# Altium project PCB_Project_3.PrjPcb
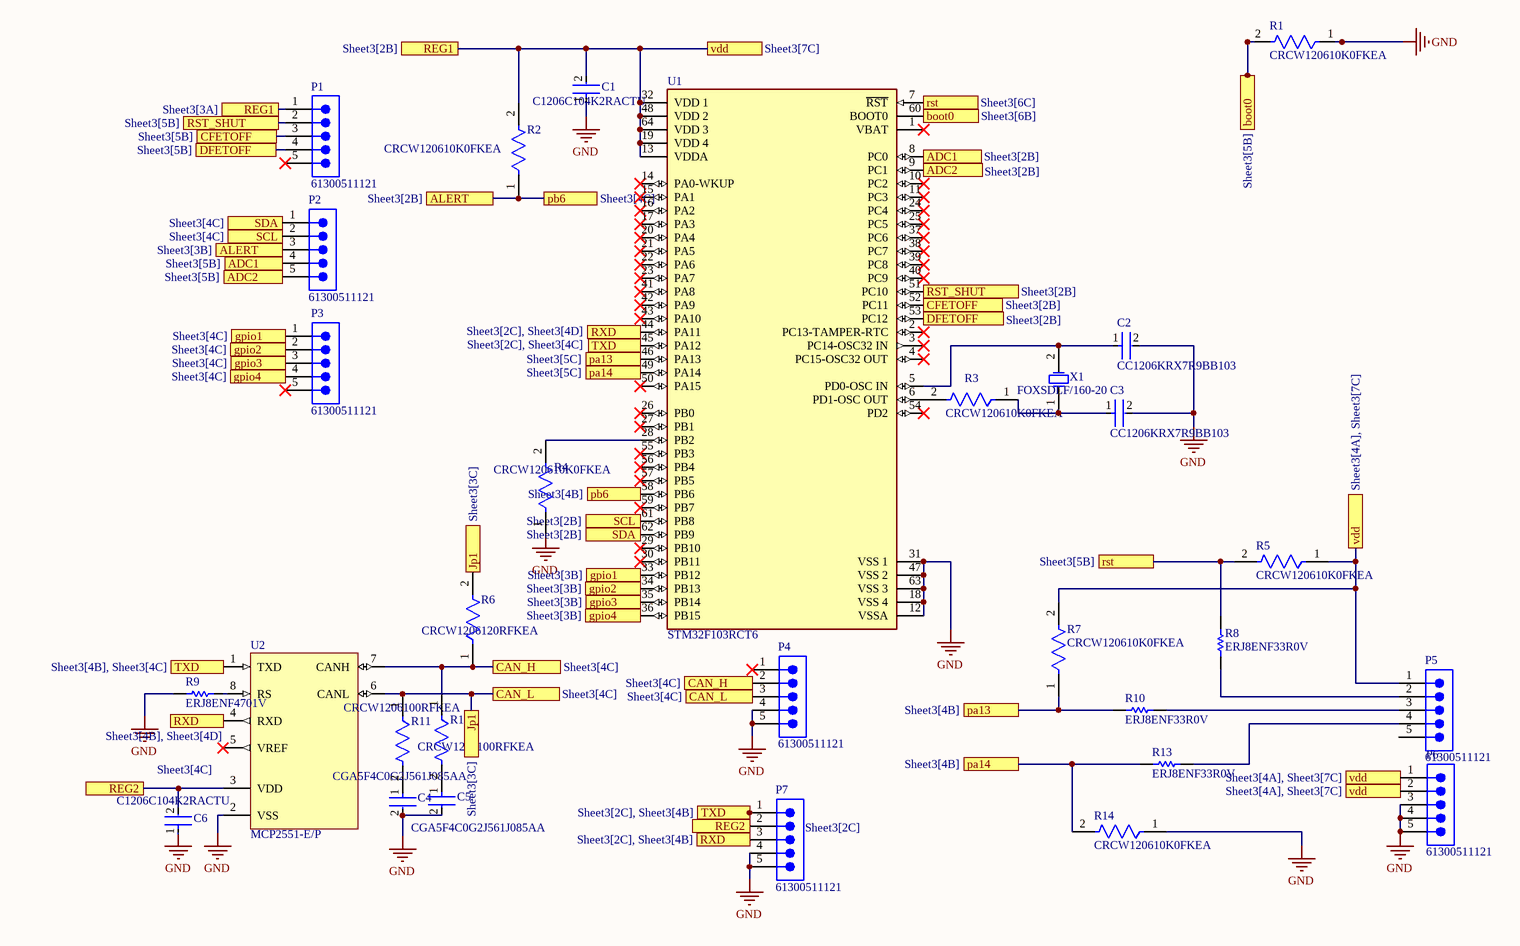
[diagram p0: Sheet3.SchDoc]
2 sheets, 116 parts. Net scope: flat (ports and power ports of the same name join across sheets).
Board file: PCB1.PcbDoc
Sheets:
  Sheet3.SchDoc
  Sheet1.SchDoc

## Sheet Sheet3.SchDoc
size A3; SheetNumber: 1; SheetTotal: 2

### Parts
C1  C1206C104K2RACTU  [FP-C1206C-EB-MFG]
C2  CC1206KRX7R9BB103  [FP-CC1206-1_25-MFG]
C3  CC1206KRX7R9BB103  [FP-CC1206-1_25-MFG]
C4  CGA5F4C0G2J561J085AA  [FP-CGA5L-0_3-0_1-MFG]
C5  CGA5F4C0G2J561J085AA  [FP-CGA5L-0_3-0_1-MFG]
C6  C1206C104K2RACTU  [FP-C1206C-EB-MFG]
P1  61300511121  [61300511121]
P2  61300511121  [61300511121]
P3  61300511121  [61300511121]
P4  61300511121  [61300511121]
P5  61300511121  [61300511121]
P6  61300511121  [61300511121]
P7  61300511121  [61300511121]
R1  CRCW120610K0FKEA  [FP-CRCW1206-e3-IPC_C]
R2  CRCW120610K0FKEA  [FP-CRCW1206-e3-IPC_C]
R3  CRCW120610K0FKEA  [FP-CRCW1206-e3-IPC_C]
R4  CRCW120610K0FKEA  [FP-CRCW1206-e3-IPC_C]
R5  CRCW120610K0FKEA  [FP-CRCW1206-e3-IPC_C]
R6  CRCW1206120RFKEA  [FP-CRCW1206-e3-MFG]
R7  CRCW120610K0FKEA  [FP-CRCW1206-e3-IPC_C]
R8  ERJ8ENF33R0V  [RESC3216X70X50LL05T20]
R9  ERJ8ENF4701V  [RESC3216X70X50LL05T20]
R10  ERJ8ENF33R0V  [RESC3216X70X50LL05T20]
R11  CRCW1206100RFKEA  [FP-CRCW1206-e3-MFG]
R12  CRCW1206100RFKEA  [FP-CRCW1206-e3-MFG]
R13  ERJ8ENF33R0V  [RESC3216X70X50LL05T20]
R14  CRCW120610K0FKEA  [FP-CRCW1206-e3-IPC_C]
U1  STM32F103RCT6  [FP-LQFP64-5W-MFG]
U2  MCP2551-E/P  [PDIP300-P8]
X1  FOXSDLF/160-20  [FOX-FOXSDLF160-20_V]

### Ports
ADC1 (see Sheet3[2B]), ADC1 (see Sheet3[5B]), ADC2 (see Sheet3[2B]), ADC2 (see Sheet3[5B]), ALERT (see Sheet3[2B]), ALERT (see Sheet3[3B]), boot0 (see Sheet3[5B]), boot0 (see Sheet3[6B]), CAN_H (see Sheet3[4C]), CAN_L (see Sheet3[4C]), CFETOFF (see Sheet3[2B]), CFETOFF (see Sheet3[5B]), DFETOFF (see Sheet3[2B]), DFETOFF (see Sheet3[5B]), gpio1 (see Sheet3[3B]), gpio1 (see Sheet3[4C]), gpio2 (see Sheet3[3B]), gpio2 (see Sheet3[4C]), gpio3 (see Sheet3[3B]), gpio3 (see Sheet3[4C]), gpio4 (see Sheet3[3B]), gpio4 (see Sheet3[4C]), Jp1 (see Sheet3[3C]), pa13 (see Sheet3[4B]), pa13 (see Sheet3[5C]), pa14 (see Sheet3[4B]), pa14 (see Sheet3[5C]), pb6 (see Sheet3[4B]), pb6 (see Sheet3[4C]), REG1 (see Sheet3[2B]), REG1 (see Sheet3[3A]), REG2 (see Sheet3[2C]), REG2 (see Sheet3[4C]), rst (see Sheet3[5B]), rst (see Sheet3[6C]), RST_SHUT (see Sheet3[2B]), RST_SHUT (see Sheet3[5B]), RXD (see Sheet3[2C], Sheet3[4B]), RXD (see Sheet3[2C], Sheet3[4D]), RXD (see Sheet3[4B], Sheet3[4D]), SCL (see Sheet3[2B]), SCL (see Sheet3[4C]), SDA (see Sheet3[2B]), SDA (see Sheet3[4C]), TXD (see Sheet3[2C], Sheet3[4B]), TXD (see Sheet3[2C], Sheet3[4C]), TXD (see Sheet3[4B], Sheet3[4C]), vdd (see Sheet3[4A], Sheet3[7C]), vdd (see Sheet3[7C])

### Nets
GND: C1.1 C2.2 C3.2 C4.2 C5.2 C6.1 P4.4 P4.5 P6.3 P6.4 P6.5 P7.4 P7.5 R1.1 R4.1 R9.1 R14.1 U1.12(VSSA) U1.18(VSS_4) U1.31(VSS_1) U1.47(VSS_2) U1.63(VSS_3) U2.2(VSS)
NetC1_2: C1.2 P1.1 P5.1 P6.1 P6.2 R2.2 R5.1 R7.2 U1.13(VDDA) U1.19(VDD_4) U1.32(VDD_1) U1.48(VDD_2) U1.64(VDD_3) ; port vdd, port REG1
NetC2_1: C2.1 U1.5(PD0-OSC_IN) X1.2(X2)
NetC3_1: C3.1 R3.1 X1.1(X1)
NetC4_1: C4.1 R11.2
NetC5_1: C5.1 R12.2
NetC6_2: C6.2 P7.2 U2.3(VDD) ; port REG2
NetP1_2: P1.2 U1.51(PC10) ; port RST_SHUT
NetP1_3: P1.3 U1.52(PC11) ; port CFETOFF
NetP1_4: P1.4 U1.53(PC12) ; port DFETOFF
NetP2_1: P2.1 U1.62(PB9) ; port SDA
NetP2_2: P2.2 U1.61(PB8) ; port SCL
NetP2_3: P2.3 R2.1 U1.58(PB6) ; port ALERT, port pb6
NetP2_4: P2.4 U1.8(PC0) ; port ADC1
NetP2_5: P2.5 U1.9(PC1) ; port ADC2
NetP3_1: P3.1 U1.33(PB12) ; port gpio1
NetP3_2: P3.2 U1.34(PB13) ; port gpio2
NetP3_3: P3.3 U1.35(PB14) ; port gpio3
NetP3_4: P3.4 U1.36(PB15) ; port gpio4
NetP4_2: P4.2 R6.1 R12.1 U2.7(CANH) ; port CAN_H
NetP4_3: P4.3 R6.2 R11.1 U2.6(CANL) ; port Jp1, port CAN_L
NetP5_2: P5.2 R8.1
NetP5_3: P5.3 R10.2
NetP5_4: P5.4 R13.2
NetP7_1: P7.1 U1.45(PA12) U2.1(TXD) ; port TXD
NetP7_3: P7.3 U1.44(PA11) U2.4(RXD) ; port RXD
NetR1_2: R1.2 U1.60(BOOT0) ; port boot0
NetR3_2: R3.2 U1.6(PD1-OSC_OUT)
NetR4_2: R4.2 U1.28(PB2)
NetR5_2: R5.2 R8.2 U1.7(~{RST}) ; port rst
NetR7_1: R7.1 R10.1 U1.46(PA13) ; port pa13
NetR9_2: R9.2 U2.8(RS)
NetR13_1: R13.1 R14.2 U1.49(PA14) ; port pa14

Not connected (* = marked no-connect by the designer): P1 5*; P3 5*; P4 1*; P5 5; U1 1(VBAT)* 2(PC13-TAMPER-RTC)* 3(PC14-OSC32_IN)* 4(PC15-OSC32_OUT)* 10(PC2)* 11(PC3)* 14(PA0-WKUP)* 15(PA1)* 16(PA2)* 17(PA3)* 20(PA4)* 21(PA5)* 22(PA6)* 23(PA7)* 24(PC4)* 25(PC5)* 26(PB0)* 27(PB1)* 29(PB10)* 30(PB11)* 37(PC6)* 38(PC7)* 39(PC8)* 40(PC9)* 41(PA8)* 42(PA9)* 43(PA10)* 50(PA15)* 54(PD2)* 55(PB3)* 56(PB4)* 57(PB5)* 59(PB7)*; U2 5(VREF)*

### Library data of the parts
C1 C6 = CMP-1037-04222-2: CAP CER 0.1UF 200V 10% X7R 1206; Manufacturer: KEMET; Automotive Grade: Grade 0; Tolerance: 0.1; Value: 0.10 μF; Material: Ceramic; Temperature Coefficient: 15%; Automotive: Yes; Temperature Characteristic: X7R; Digikey Description: CAP CER 0.1UF 200V 10% X7R 1206; ComponentLink2URL: https://content.kemet.com/datasheets/KEM_C1007_X8R_ULTRA_150C_SMD.pdf; Voltage Rating: 200 V; Manufacturer Part Number: C1206C104K2RACTU; Temperature Range High: +150°C; Device Class L1: Passive Components; Octopart: https://octopart.com/c1206c104k2ractu-kemet-9138344; Temperature: -55°C to +150°C; Height: 0.88mm; Device Class L3: Ceramic Capacitors; Lead Free: Yes; Package: C1206C-EB; Category: Cap; Temperature Range Low: -55°C; Mouser Description: Multilayer Ceramic Capacitors MLCC - SMD/SMT 200volts 0.1uF X7R 10%; Ipc Land Pattern Name: CAPC320160X78; Capacitance: 0.10 μF; RoHS: TRUE; ComponentLink2Description: Datasheet; Device Class L2: Capacitors
C2 C3 = CMP-1037-03511-2: CAP CER 10000PF 50V X7R 1206; Manufacturer: Yageo; Automotive Grade: NA; Temperature Coefficient: 15%; Tolerance: 0.1; Capacitance: 10 nF; Value: 10 nF; Material: Ceramic; RoHS: TRUE; Lead Free: Yes; Category: Cap; Temperature Characteristic: X7R; ComponentLink2Description: Datasheet; Device Class L2: Capacitors; Voltage Rating: 50 V; Octopart: https://octopart.com/cc1206krx7r9bb103-yageo-39467800; Temperature Range Low: -55°C; Digikey Description: CAP CER 10000PF 50V X7R 1206; ComponentLink2URL: http://www.yageo.com/documents/recent/UPY-NP0X7R_HV_1KV-to-3KV_11.pdf; Package: CC1206-1.25; Height: 1.45mm; Automotive: No; Mouser Description: Multilayer Ceramic Capacitors MLCC - SMD/SMT 10nF 50V X7R 10%; Temperature Range High: +125°C; Manufacturer Part Number: CC1206KRX7R9BB103; Device Class L3: Ceramic Capacitors; Temperature: -55°C to +125°C; Footprint Url: http://www.yageo.com/exep/pages/download/literatures/UPY-C_GEN_24.pdf; Device Class L1: Passive Components
C4 C5 = CMP-08246-001106-1: Cap Ceramic 560pF 630V C0G 5% Pad SMD 1206 +125°C Automotive T/R; Height: 0.85mm; Mount: Surface Mount; Packaging: Tape and Reel; Thickness: 0.03inch; Case/Package: 1206; REACH SVHC: No SVHC; Ratings: AEC-Q200; Termination: SMD/SMT; Voltage Rating (DC): 630V; Package Quantity: 1; Dielectric: C0G; Width: 1.6mm; Tolerance: 5%; Depth: 1.6mm; Weight: 0.000571oz; Case Code (Metric): 3216; Length: 3.2mm; Capacitance: 560pF; Case Code (Imperial): 1206; Composition: Ceramic; Voltage Rating: 630V; Min Operating Temperature: -55°C; Max Operating Temperature: 125°C
P1-P7 = CMP-1502-01068-3: NexarPartId: 32855526; Connector Type: Male Pin; Gender: Male; Contact Resistance: 20mΩ; Pitch: 2.54mm; Operating Supply Voltage: 250V; Current Rating: 3A; Number of Contacts: 5; Lead Free: Lead Free; Color: Black; Packaging: Bulk; Lead Pitch: 2.54mm; Contact Material: Copper; Min Operating Temperature: -40°C; Contact Mating Length: 5.9944mm; Voltage Rating: 250V; Number of Pins: 5; Number of Positions: 5; Height: 8.89mm; Orientation: Vertical; REACH SVHC: Unknown; RoHS: Compliant; Contact Plating: Gold; Max Operating Temperature: 105°C; Mount: Through Hole; Number of Rows: 1; Termination: Solder
R1-R5 R7 R14 = CMP-2003-04807-2: RES Thick Film, 10kΩ, 1%, 0.25W, 100ppm/°C, 1206; Working Voltage: 200V; Max Power Dissipation: 250mW; Resistance: 10kR; Tolerance: 1%; Width: 0.063inch; Height: 0.55mm; Number of Pins: 2; Voltage Rating: 200V; Temperature Coefficient: 100ppm/°C; Military Standard: Not; Features: Automotive AEC-Q200; Depth: 1.6mm; Radiation Hardening: No; Termination: SMD/SMT; Case Code (Imperial): 1206; Weight: 0.000353oz; Length: 3.2mm; Package Quantity: 10; Voltage Rating (DC): 200V; Case/Package: 1206; Min Operating Temperature: -55°C; Number of Terminations: 2; Composition: Thick Film; Contact Plating: Tin; Power Rating: 250mW; Packaging: Tape and Reel; Max Operating Temperature: 155°C; Lead Free: Lead Free; Case Code (Metric): 3216
R6 = CMP-2003-04838-2: RES Thick Film, 120Ω, 1%, 0.25W, 100ppm/°C, 1206; Power Rating: 250mW; Voltage Rating: 200V; Resistance: 120R; Length: 3.2mm; Tolerance: 1%; Weight: 0.000353oz; Temperature Coefficient: 100ppm/°C; Case/Package: 1206; Lead Free: Lead Free; Case Code (Metric): 3216; Min Operating Temperature: -55°C; Package Quantity: 10; Mount: Surface Mount; Height: 0.55mm; Packaging: Tape and Reel; Number of Terminations: 2; Composition: Thick Film; Width: 0.063inch; Voltage Rating (DC): 200V; Radiation Hardening: No; Contact Plating: Tin; Case Code (Imperial): 1206; Termination: SMD/SMT; Max Power Dissipation: 250mW; Features: Automotive AEC-Q200; Military Standard: Not; Depth: 1.6mm; Max Operating Temperature: 155°C
R8 R10 R13 = CMP-2003-00837-1: Manufacturer: Panasonic; Part Number: ERJ8ENF33R0V
R9 = CMP-2003-00848-1: Manufacturer: Panasonic; Part Number: ERJ8ENF4701V
R11 R12 = CMP-2003-04801-2: RES Thick Film, 100Ω, 1%, 0.25W, 100ppm/°C, 1206; Voltage Rating (DC): 200V; Resistance: 100R; Power Rating: 250mW; Case Code (Metric): 3216; Radiation Hardening: No; Height: 0.55mm; Packaging: Tape and Reel; Depth: 1.6mm; Weight: 0.000353oz; Termination: SMD/SMT; Lead Free: Lead Free; Min Operating Temperature: -55°C; Contact Plating: Tin; Max Operating Temperature: 155°C; Case Code (Imperial): 1206; Military Standard: Not; Width: 1.6mm; Number of Pins: 2; Voltage Rating: 200V; Composition: Thick Film; Package Quantity: 5000; Tolerance: 1%; Case/Package: 1206; Mount: Surface Mount; Length: 3.2mm; Temperature Coefficient: 100ppm/°C
U1 = CMP-0237-00009-5: IC MCU 32BIT 256KB FLASH 64LQFP; Interface: I2C; Number of I/Os: 51; Number of SPI Channels: 3; Min Supply Voltage: 2V; Peripherals: POR; Max Frequency: 72MHz; Max Power Dissipation: 444mW; Number of Timers/Counters: 8; Data Bus Width: 32b; Number of ADC Channels: 16; RAM Size: 48KB; Max Supply Voltage: 3.6V; Number of I2C Channels: 2; Watchdog Timer: Yes; Oscillator Type: Internal; Core Architecture: ARM; Number of Bits: 32; Package Quantity: 960; REACH SVHC: No SVHC; Width: 10mm; Weight: 0.012088oz; Max Operating Temperature: 85°C; Radiation Hardening: No; Length: 10mm; Height: 1.4mm; Number of Programmable I/O: 51; Frequency: 72MHz; Series: STM32F103RC; Min Operating Temperature: -40°C; Number of PWM Channels: 16; Memory Size: 256KB; Lead Free: Lead Free; Packaging: Tray; Termination: SMD/SMT; RoHS Compliant: Yes; Number of Pins: 64; Case/Package: LQFP; Density: 256KB; Memory Type: FLASH
U2 = CMP-0186-00100-2: High-Speed CAN Transceiver, 8-Pin PDIP, Extended Temperature; PackageReference: PDIP300-P8; DatasheetVersion: revF, Jul-2010; ComponentLink2URL: http://ww1.microchip.com/downloads/en/DeviceDoc/21667F.pdf; ComponentLink2Description: Datasheet; Code_JEDEC: MS-001; ComponentLink1URL: http://www.microchip.com/; RevisionNote: URLs added. DatasheetVersion updated.; PackageVersion: revBB, Aug-2009; ComponentLink3Description: Package Specification; PackageDescription: 8-Lead Plastic Dual In-Line (P) - 300 mil Body [PDIP]; ComponentLink1Description: Manufacturer URL; ComponentLink3URL: http://www.microchip.com/stellent/groups/techpub_sg/documents/packagingspec/en012702.pdf
X1 = CMP-1749-00001-1: Resistance Weld SMD Crystal, 16 MHz, +/- 30 ppm, 20 pF, -20 to 70 degC, 2-Pin SMD, RoHS, Tape and Reel; Output Current: 3 mA; Case\Package: SOT-553-6; Min Supply Voltage (DC): 4 V; Max Supply Voltage: 3.3 V; Min Supply Voltage: 1.4 V; Interface: I2C; Max Supply Voltage (DC): 6 V; ComponentLink2Description: Datasheet; REACH SVHC: No SVHC; ComponentLink1URL: http://www.foxonline.com/; ComponentLink2URL: http://foxonline.com/pdfs/hc49sdlf.pdf; Pins: 6; Packaging: Cut Tape; ComponentLink1Description: Manufacturer URL; Weight: 9.9E-05 oz; Length: 1.6 mm; RoHSCompliant: true; Min Operating Temperature: -55 degC; Radiation Hardening: No; PackageDescription: 2-Pin Surface Mount Device, Body 5 x 11.7 mm, Height 4.5 mm; Package Quantity: 1; Width: 1.2 mm; DatasheetVersion: Mar-15; Max Operating Temperature: 150 degC; Mount: Surface Mount; PackageReference: FOX-FOXSDLF160-20; Height: 0.55 mm

## Sheet Sheet1.SchDoc
size A1; SheetNumber: 2; SheetTotal: 2
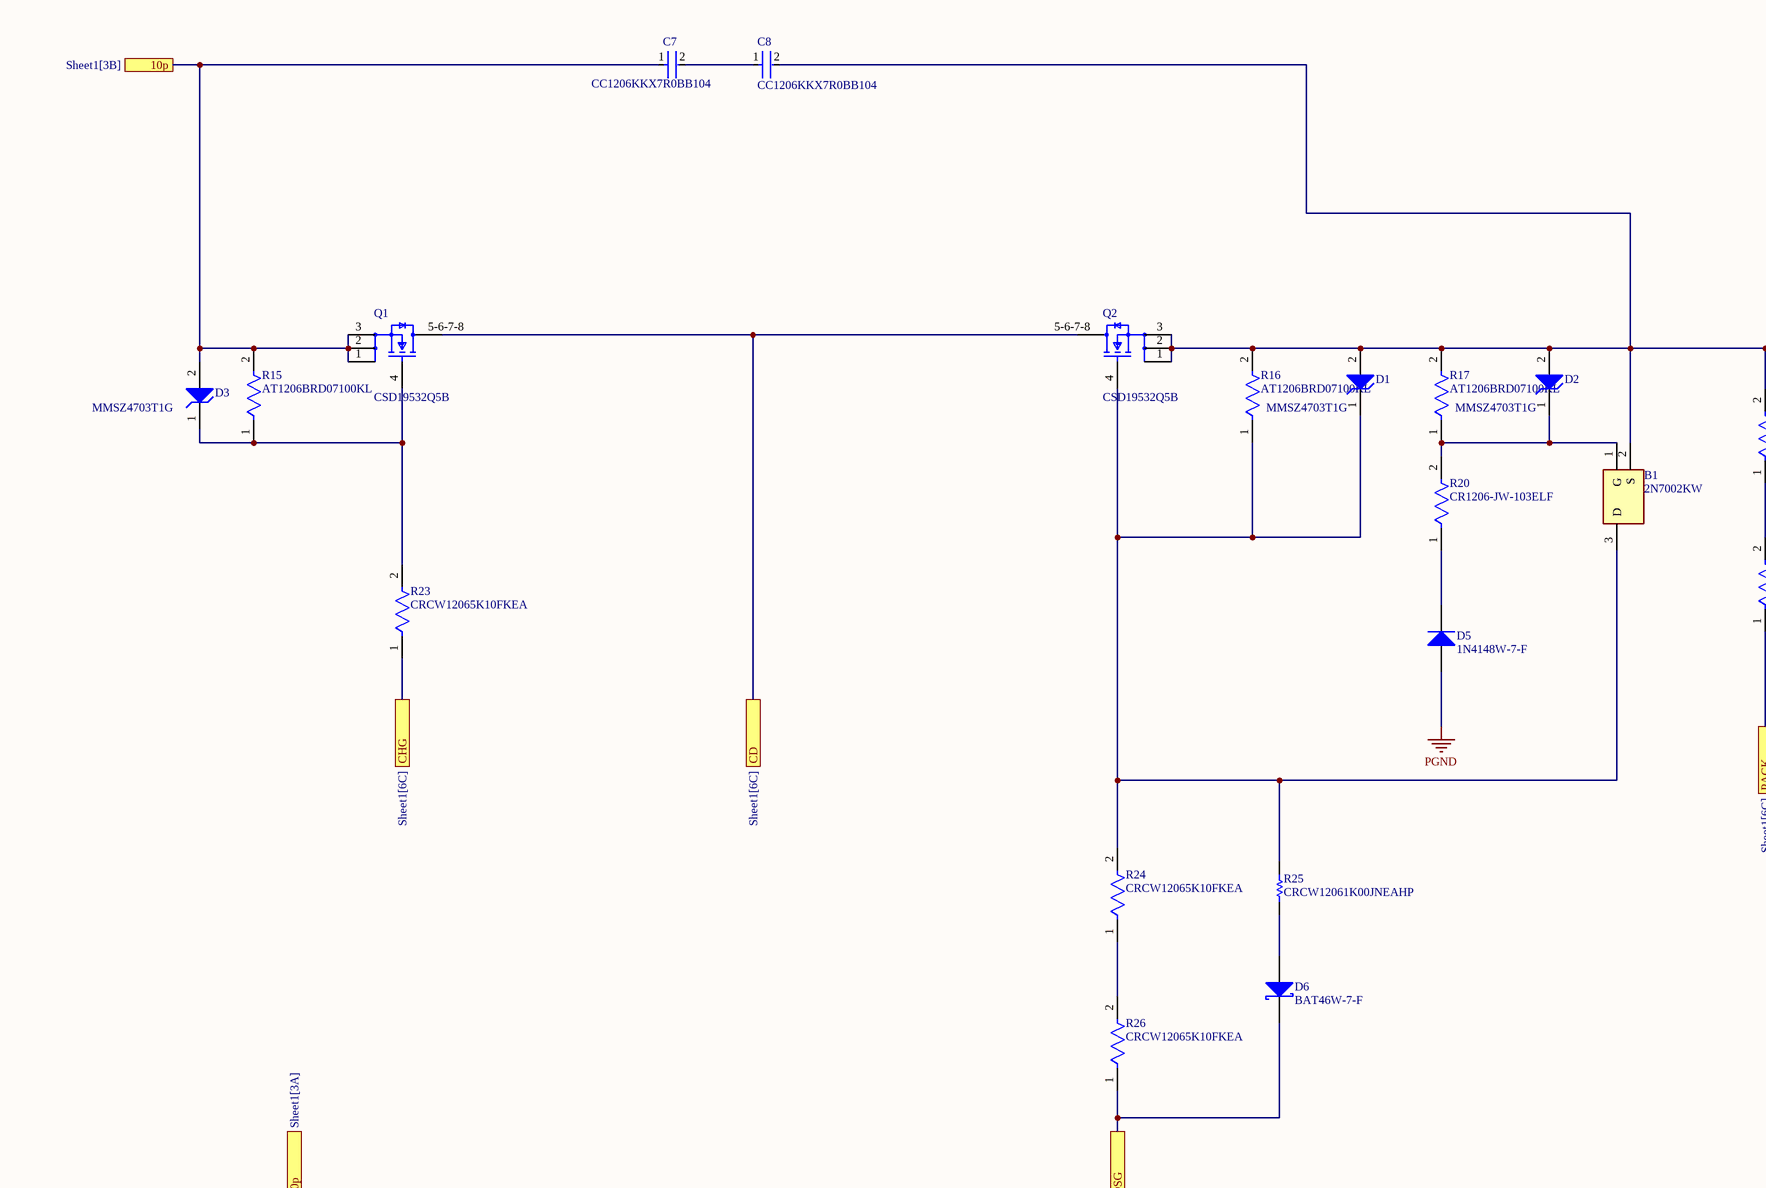
[diagram p1: Sheet1.SchDoc, top left]
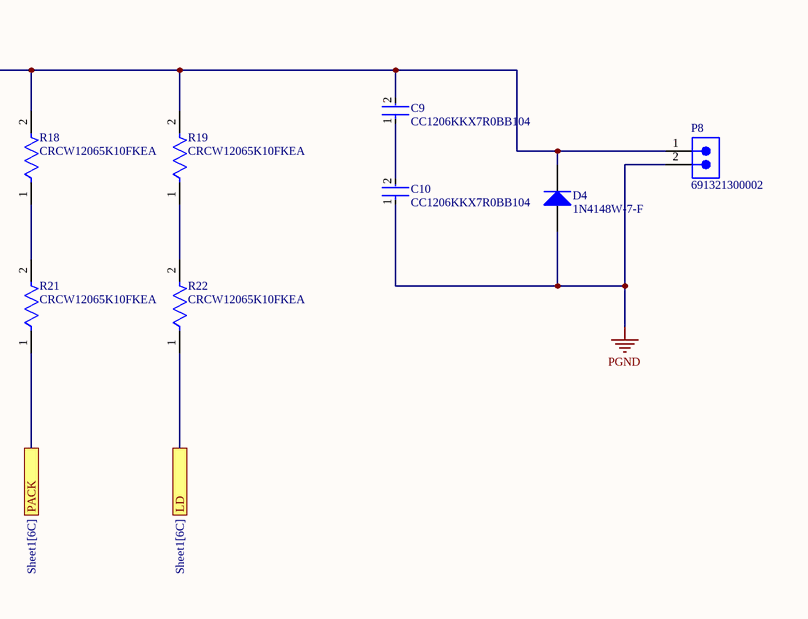
[diagram p2: Sheet1.SchDoc, top right]
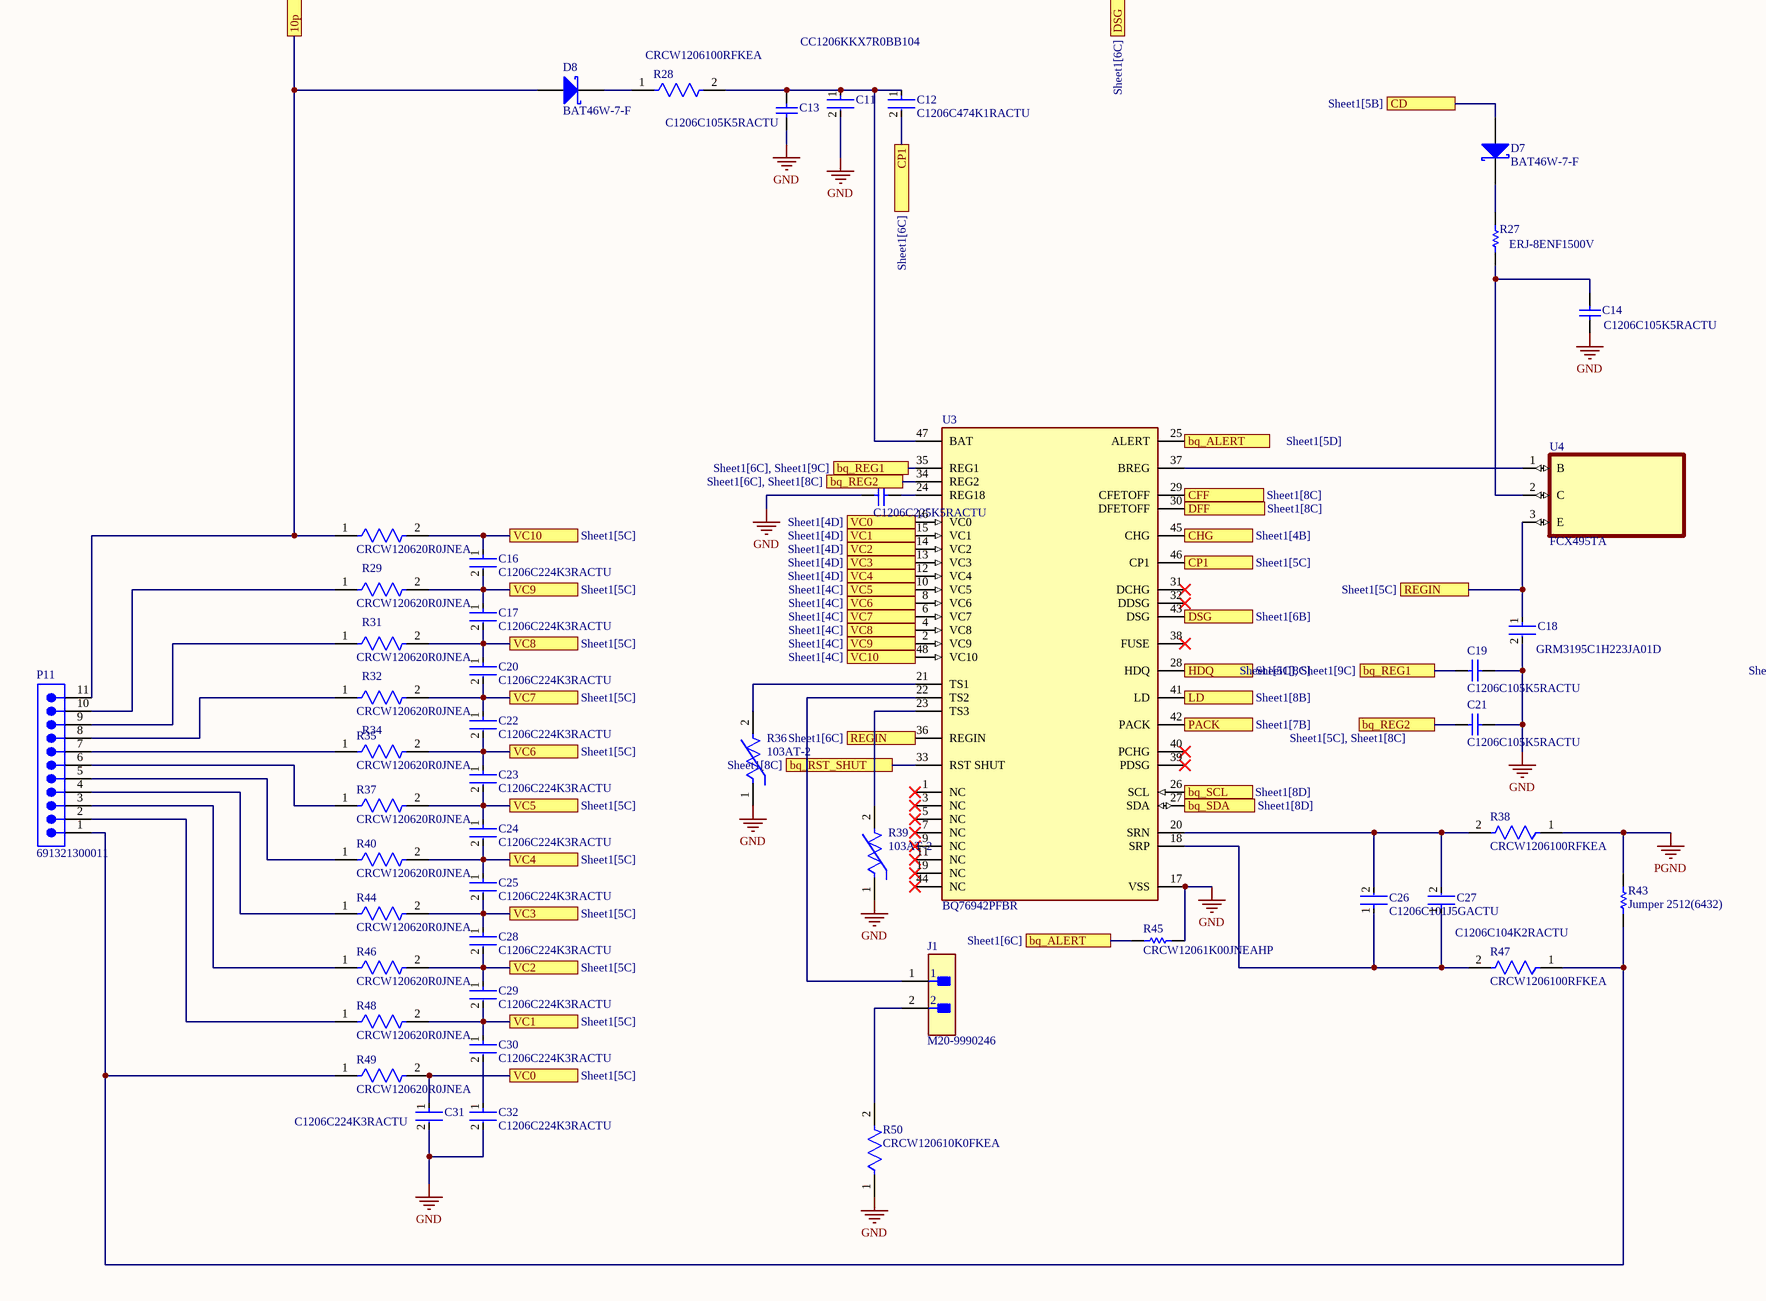
[diagram p3: Sheet1.SchDoc, bottom left]
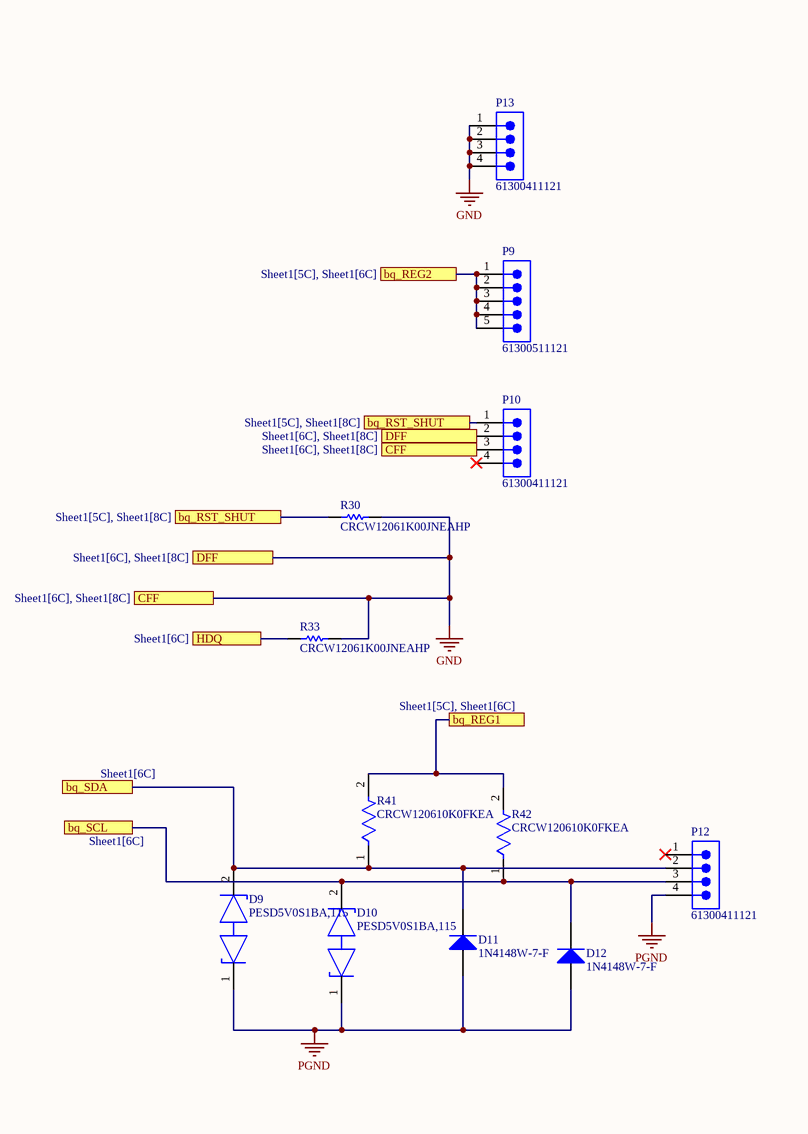
[diagram p4: Sheet1.SchDoc, bottom right]

### Parts
B1  2N7002KW  [SOT65P210X110-3N]
C7  CC1206KKX7R0BB104  [FP-CC1206-0_3-1_45-IPC_C]
C8  CC1206KKX7R0BB104  [FP-CC1206-0_3-1_45-IPC_C]
C9  CC1206KKX7R0BB104  [FP-CC1206-0_3-1_45-IPC_C]
C10  CC1206KKX7R0BB104  [FP-CC1206-0_3-1_45-IPC_C]
C11  CC1206KKX7R0BB104  [FP-CC1206-0_3-1_45-IPC_C]
C12  C1206C474K1RACTU  [FP-C1206C-EB-MFG]
C13  C1206C105K5RACTU  [CAPC3216X110X50LL20T25]
C14  C1206C105K5RACTU  [CAPC3216X110X50LL20T25]
C15  C1206C225K5RACTU  [CAPC3216X180X50LL20T25]
C16  C1206C224K3RACTU  [FP-C1206C-EB-MFG]
C17  C1206C224K3RACTU  [FP-C1206C-EB-MFG]
C18  GRM3195C1H223JA01D  [FP-GRM319-0_15-IPC_C]
C19  C1206C105K5RACTU  [CAPC3216X110X50LL20T25]
C20  C1206C224K3RACTU  [FP-C1206C-EB-MFG]
C21  C1206C105K5RACTU  [CAPC3216X110X50LL20T25]
C22  C1206C224K3RACTU  [FP-C1206C-EB-MFG]
C23  C1206C224K3RACTU  [FP-C1206C-EB-MFG]
C24  C1206C224K3RACTU  [FP-C1206C-EB-MFG]
C25  C1206C224K3RACTU  [FP-C1206C-EB-MFG]
C26  C1206C101J5GACTU  [FP-C1206C-EB-MFG]
C27  C1206C104K2RACTU  [FP-C1206C-EB-MFG]
C28  C1206C224K3RACTU  [FP-C1206C-EB-MFG]
C29  C1206C224K3RACTU  [FP-C1206C-EB-MFG]
C30  C1206C224K3RACTU  [FP-C1206C-EB-MFG]
C31  C1206C224K3RACTU  [FP-C1206C-EB-MFG]
C32  C1206C224K3RACTU  [FP-C1206C-EB-MFG]
D1  MMSZ4703T1G  [ONSC-SOD-123-2-425-04_V]
D2  MMSZ4703T1G  [ONSC-SOD-123-2-425-04_V]
D3  MMSZ4703T1G  [ONSC-SOD-123-2-425-04_V]
D4  1N4148W-7-F  [DIOD-SOD123-2_V]
D5  1N4148W-7-F  [DIOD-SOD123-2_V]
D6  BAT46W-7-F  [DIOD-SOD-123-2_V]
D7  BAT46W-7-F  [DIOD-SOD-123-2_V]
D8  BAT46W-7-F  [DIOD-SOD-123-2_V]
D9  PESD5V0S1BA,115  [FP-SOD323-CA-MFG]
D10  PESD5V0S1BA,115  [FP-SOD323-CA-MFG]
D11  1N4148W-7-F  [DIOD-SOD123-2_V]
D12  1N4148W-7-F  [DIOD-SOD123-2_V]
J1  M20-9990246  [FP-M20-9990246-MFG]
P8  691321300002  [691321300002]
P9  61300511121  [61300511121]
P10  61300411121  [61300411121]
P11  691321300011  [691321300011]
P12  61300411121  [61300411121]
P13  61300411121  [61300411121]
Q1  CSD19532Q5B  [FP-DNK0008A-MFG]
Q2  CSD19532Q5B  [FP-DNK0008A-MFG]
R15  AT1206BRD07100KL  [FP-AT1206-IPC_B]
R16  AT1206BRD07100KL  [FP-AT1206-IPC_B]
R17  AT1206BRD07100KL  [FP-AT1206-IPC_B]
R18  CRCW12065K10FKEA  [FP-CRCW1206-e3-IPC_C]
R19  CRCW12065K10FKEA  [FP-CRCW1206-e3-IPC_C]
R20  CR1206-JW-103ELF  [FP-CR1206-IPC_B]
R21  CRCW12065K10FKEA  [FP-CRCW1206-e3-IPC_C]
R22  CRCW12065K10FKEA  [FP-CRCW1206-e3-IPC_C]
R23  CRCW12065K10FKEA  [FP-CRCW1206-e3-IPC_C]
R24  CRCW12065K10FKEA  [FP-CRCW1206-e3-IPC_C]
R25  CRCW12061K00JNEAHP  [RESC3116X65X50LL20T20]
R26  CRCW12065K10FKEA  [FP-CRCW1206-e3-IPC_C]
R27  ERJ-8ENF1500V  [RESC3216X70X50LL05T20]
R28  CRCW1206100RFKEA  [FP-CRCW1206-e3-MFG]
R29  CRCW120620R0JNEA  [FP-CRCW1206-e3-IPC_A]
R30  CRCW12061K00JNEAHP  [RESC3116X65X50LL20T20]
R31  CRCW120620R0JNEA  [FP-CRCW1206-e3-IPC_A]
R32  CRCW120620R0JNEA  [FP-CRCW1206-e3-IPC_A]
R33  CRCW12061K00JNEAHP  [RESC3116X65X50LL20T20]
R34  CRCW120620R0JNEA  [FP-CRCW1206-e3-IPC_A]
R35  CRCW120620R0JNEA  [FP-CRCW1206-e3-IPC_A]
R36  103AT-2  [FP-103AT-2-MFG]
R37  CRCW120620R0JNEA  [FP-CRCW1206-e3-IPC_A]
R38  CRCW1206100RFKEA  [FP-CRCW1206-e3-MFG]
R39  103AT-2  [FP-103AT-2-MFG]
R40  CRCW120620R0JNEA  [FP-CRCW1206-e3-IPC_A]
R41  CRCW120610K0FKEA  [FP-CRCW1206-e3-IPC_C]
R42  CRCW120610K0FKEA  [FP-CRCW1206-e3-IPC_C]
R43  Jumper 2512(6432)  [RESC2512(6432)_L]
R44  CRCW120620R0JNEA  [FP-CRCW1206-e3-IPC_A]
R45  CRCW12061K00JNEAHP  [RESC3116X65X50LL20T20]
R46  CRCW120620R0JNEA  [FP-CRCW1206-e3-IPC_A]
R47  CRCW1206100RFKEA  [FP-CRCW1206-e3-MFG]
R48  CRCW120620R0JNEA  [FP-CRCW1206-e3-IPC_A]
R49  CRCW120620R0JNEA  [FP-CRCW1206-e3-IPC_A]
R50  CRCW120610K0FKEA  [FP-CRCW1206-e3-IPC_C]
U3  BQ76942PFBR  [FP-PFB0048A-IPC_C]
U4  FCX495TA  [VREG_AP2204RA-3.3TRG1]

### Ports
10p (see Sheet1[3A]), 10p (see Sheet1[3B]), bq_ALERT (see Sheet1[5D]), bq_ALERT (see Sheet1[6C]), bq_REG1 (see Sheet1[5C], Sheet1[6C]), bq_REG1 (see Sheet1[5C], Sheet1[9C]), bq_REG1 (see Sheet1[6C], Sheet1[9C]), bq_REG2 (see Sheet1[5C], Sheet1[6C]), bq_REG2 (see Sheet1[5C], Sheet1[8C]), bq_REG2 (see Sheet1[6C], Sheet1[8C]), bq_RST_SHUT (see Sheet1[5C], Sheet1[8C]), bq_RST_SHUT (see Sheet1[8C]), bq_SCL (see Sheet1[6C]), bq_SCL (see Sheet1[8D]), bq_SDA (see Sheet1[6C]), bq_SDA (see Sheet1[8D]), CD (see Sheet1[5B]), CD (see Sheet1[6C]), CFF (see Sheet1[6C], Sheet1[8C]), CFF (see Sheet1[8C]), CHG (see Sheet1[4B]), CHG (see Sheet1[6C]), CP1 (see Sheet1[5C]), CP1 (see Sheet1[6C]), DFF (see Sheet1[6C], Sheet1[8C]), DFF (see Sheet1[8C]), DSG (see Sheet1[6B]), DSG (see Sheet1[6C]), HDQ (see Sheet1[6C]), HDQ (see Sheet1[8C]), LD (see Sheet1[6C]), LD (see Sheet1[8B]), PACK (see Sheet1[6C]), PACK (see Sheet1[7B]), REGIN (see Sheet1[5C]), REGIN (see Sheet1[6C]), VC0 (see Sheet1[4D]), VC0 (see Sheet1[5C]), VC1 (see Sheet1[4D]), VC1 (see Sheet1[5C]), VC2 (see Sheet1[4D]), VC2 (see Sheet1[5C]), VC3 (see Sheet1[4D]), VC3 (see Sheet1[5C]), VC4 (see Sheet1[4D]), VC4 (see Sheet1[5C]), VC5 (see Sheet1[4C]), VC5 (see Sheet1[5C]), VC6 (see Sheet1[4C]), VC6 (see Sheet1[5C]), VC7 (see Sheet1[4C]), VC7 (see Sheet1[5C]), VC8 (see Sheet1[4C]), VC8 (see Sheet1[5C]), VC9 (see Sheet1[4C]), VC9 (see Sheet1[5C]), VC10 (see Sheet1[4C]), VC10 (see Sheet1[5C])

### Nets
GND: C11.2 C13.1 C14.1 C15.1 C18.2 C19.1 C21.1 C31.2 C32.2 P10.2 P10.3 P13.1 P13.2 P13.3 P13.4 R30.2 R33.2 R36.1 R39.1 R45.2 R50.1 U3.17(VSS) U3.29(CFETOFF) U3.30(DFETOFF) ; port CFF, port DFF
PGND: C10.1 D4.1(A) D5.1(A) D9.1(K1) D10.1(K1) D11.1(A) D12.1(A) P8.2 P12.4 R38.1 R43.2
NetB1_1: B1.1(G) D2.1(K) R17.1 R20.2
NetB1_2: B1.2(S) C8.2 C9.2 D1.2(A) D2.2(A) D4.2(K) P8.1 Q2.1(S) Q2.2(S) Q2.3(S) R16.2 R17.2 R18.2 R19.2
NetB1_3: B1.3(D) D1.1(K) Q2.4(G) R16.1 R24.2 R25.2
NetC7_1: C7.1 D3.2(A) D8.1(A) P11.11 Q1.1(S) Q1.2(S) Q1.3(S) R15.2 R29.1 ; port 10p
NetC7_2: C7.2 C8.1
NetC9_1: C9.1 C10.2
NetC11_1: C11.1 C12.1 C13.2 R28.2 U3.47(BAT)
NetC12_2: C12.2 U3.46(CP1) ; port CP1
NetC14_2: C14.2 R27.1 U4.2(C)
NetC15_2: C15.2 U3.24(REG18)
NetC16_1: C16.1 R29.2 U3.48(VC10) ; port VC10
NetC16_2: C16.2 C17.1 R31.2 U3.2(VC9) ; port VC9
NetC17_2: C17.2 C20.1 R32.2 U3.4(VC8) ; port VC8
NetC18_1: C18.1 U3.36(REGIN) U4.3(E) ; port REGIN
NetC19_2: C19.2 R41.2 R42.2 U3.35(REG1) ; port bq_REG1
NetC20_2: C20.2 C22.1 R34.2 U3.6(VC7) ; port VC7
NetC21_2: C21.2 P9.1 P9.2 P9.3 P9.4 P9.5 U3.34(REG2) ; port bq_REG2
NetC22_2: C22.2 C23.1 R35.2 U3.8(VC6) ; port VC6
NetC23_2: C23.2 C24.1 R37.2 U3.10(VC5) ; port VC5
NetC24_2: C24.2 C25.1 R40.2 U3.12(VC4) ; port VC4
NetC25_2: C25.2 C28.1 R44.2 U3.13(VC3) ; port VC3
NetC26_1: C26.1 C27.1 R47.2 U3.18(SRP)
NetC26_2: C26.2 C27.2 R38.2 U3.20(SRN)
NetC28_2: C28.2 C29.1 R46.2 U3.14(VC2) ; port VC2
NetC29_2: C29.2 C30.1 R48.2 U3.15(VC1) ; port VC1
NetC30_2: C30.2 C32.1
NetC31_1: C31.1 R49.2 U3.16(VC0) ; port VC0
NetD3_1: D3.1(K) Q1.4(G) R15.1 R23.2
NetD5_2: D5.2(K) R20.1
NetD6_1: D6.1(A) R25.1
NetD6_2: D6.2(K) R26.1 U3.43(DSG) ; port DSG
NetD7_1: D7.1(A) Q1.5-6-7-8(D) Q2.5-6-7-8(D) ; port CD
NetD7_2: D7.2(K) R27.2
NetD8_2: D8.2(K) R28.1
NetD9_2: D9.2(K2) D11.2(K) P12.2 R41.1 U3.27(SDA) ; port bq_SDA
NetD10_2: D10.2(K2) D12.2(K) P12.3 R42.1 U3.26(SCL) ; port bq_SCL
NetJ1_1: J1.1 U3.22(TS2)
NetJ1_2: J1.2 R50.2
NetP10_1: P10.1 R30.1 U3.33(RST_SHUT) ; port bq_RST_SHUT
NetP11_1: P11.1 R43.1 R47.1 R49.1
NetP11_2: P11.2 R48.1
NetP11_3: P11.3 R46.1
NetP11_4: P11.4 R44.1
NetP11_5: P11.5 R40.1
NetP11_6: P11.6 R37.1
NetP11_7: P11.7 R35.1
NetP11_8: P11.8 R34.1
NetP11_9: P11.9 R32.1
NetP11_10: P11.10 R31.1
NetR18_1: R18.1 R21.2
NetR19_1: R19.1 R22.2
NetR21_1: R21.1 U3.42(PACK) ; port PACK
NetR22_1: R22.1 U3.41(LD) ; port LD
NetR23_1: R23.1 U3.45(CHG) ; port CHG
NetR24_1: R24.1 R26.2
NetR33_1: R33.1 U3.28(HDQ) ; port HDQ
NetR36_2: R36.2 U3.21(TS1)
NetR39_2: R39.2 U3.23(TS3)
NetR45_1: R45.1 U3.25(ALERT) ; port bq_ALERT
NetU3_37: U3.37(BREG) U4.1(B)

Not connected (* = marked no-connect by the designer): P10 4*; P12 1*; U3 1(NC)* 3(NC)* 5(NC)* 7(NC)* 9(NC)* 11(NC)* 19(NC)* 31(DCHG)* 32(DDSG)* 38(FUSE)* 39(PDSG)* 40(PCHG)* 44(NC)*

### Library data of the parts
B1 = 2N7002KW: Ultra-Small Surface Mount Package; Low Input/Output Leakage; ESD HBM=1000V as per JESD22 A114 and ESD CDM=1500V as per JESD22 C101; Fast Switching Speed; Low Input Capacitance; Low Gate Threshold Voltage; Low On-Resistance; Manufacturer_Name: onsemi; Geometry.Height: 1.1mm; Mouser Part Number: 512-2N7002KW; Mouser Price/Stock: https://www.mouser.co.uk/ProductDetail/onsemi-Fairchild/2N7002KW?qs=1%252BQrTMB6OPVOqkaNo2cdQQ%3D%3D; Manufacturer_Part_Number: 2N7002KW; Datasheet Link: https://www.onsemi.com/pub/Collateral/2N7002KW-D.PDF
C7-C11 = CMP-03422-001499-1: CAP CER 0.1UF 100V X7R 1206; Capacitance: 100nF; Dielectric Material: Ceramic; Tolerance: 10%; Voltage: 63V; Mount: Surface Mount; Series: CC; Lead Free: Lead Free; Resistor Type: Ceramic; Depth: 1.6mm; Packaging: Tape and Reel; REACH SVHC: No SVHC; Max Operating Temperature: 125°C; Termination: SMD/SMT; Min Operating Temperature: -55°C; Number of Pins: 2; Radiation Hardening: No; Case Code (Imperial): 1206; Package Quantity: 1; Height: 1.25mm; Thickness: 0.057inch; Length: 3.2mm; Case Code (Metric): 3216; Case/Package: 1206; Dielectric: X7R; RoHS Compliant: Yes; Width: 0.063inch; Voltage Rating (DC): 100V; Voltage Rating: 100V
C12 = CMP-03020-023340-1: CAP CER 0.47UF 100V 10% X7R 1206; Manufacturer: KEMET; Temperature Coefficient: 15%; Value: 0.47 μF; Tolerance: 0.1; Material: Ceramic; Automotive Grade: Grade 0; Temperature Range High: +150°C; Package: C1206C-EB; Category: Cap; Octopart: https://octopart.com/c1206c474k1ractu-kemet-8699488; Lead Free: Yes; ComponentLink2URL: https://content.kemet.com/datasheets/KEM_C1007_X8R_ULTRA_150C_SMD.pdf; Temperature: -55°C to +150°C; RoHS: TRUE; Ipc Land Pattern Name: CAPC320160X78; ComponentLink2Description: Datasheet; Device Class L2: Capacitors; Digikey Description: CAP CER 0.47UF 100V 10% X7R 1206; Height: 0.88mm; Device Class L1: Passive Components; Temperature Characteristic: X7R; Mouser Description: Cap Ceramic 0.47uF 100V X7R 10% SMD 1206 125°C Plastic T/R; Temperature Range Low: -55°C; Capacitance: 0.47 μF; Manufacturer Part Number: C1206C474K1RACTU; Device Class L3: Ceramic Capacitors; Automotive: Yes; Voltage Rating: 100 V
C13 C14 C19 C21 = CMP-2000-06011-1: Chip Capacitor, 1 uF, +/- 10%, 50 V, -55 to 125 degC, 1206 (3216 Metric), RoHS, Tape and Reel; Manufacturer: Kemet; Case Height: 1mm; Dielectric: X7R; Voltage Rating: 50V; Capacitance: 1uF; Temperature Coefficient / Code: +/-15%; Case Length: 3.2mm; Case Width: 1.6mm; Type: SMDMLCCX7R6.3-250VDCCommericalGrade; Class: Class1; Capacitance - nF: 1000nF; Datasheet URL: http://www.kemet.com/docfinder?Partnumber=C1206C105K5RACTU; Product Category: MultilayerCeramicCapacitorsMLCC-SMD/SMT; Termination Style: SMD/SMT; Dimensions: 1.6mmWx3.2mmLx1mmH; Voltage Rating DC: 50V; Datasheet Version: 02/2016; Packaging: Reel; Brand: Kemet; RoHS: Details; Minimum Operating Temperature: -55C; Operating Temperature Range: -55Cto+125C; Package Reference: 1206; Manufacturer URL: http://www.kemet.com/; Product: GeneralTypeMLCCs; Tolerance: 10%; Package Description: 2-Pin Surface Mount Device, Body 3.2 x 1.6 mm; Mounting Technology: SurfaceMount; Case Code - mm: 3216; Maximum Operating Temperature: +125C; Series: C1206C; Factory Pack Quantity: 2500; Package / Case: 1206(3216metric); Case Code - in: 1206
C15 = CMP-1037-04831-2: Chip Capacitor, 2.2 uF, +/- 10%, 50 V, -55 to 125 degC, 1206 (3216 Metric), RoHS, Tape and Reel; Manufacturer: Kemet; Case Width: 1.6mm; Capacitance - nF: 2200nF; Capacitance: 2.2uF; Class: Class1; Type: SMDMLCCX7R6.3-250VDCCommericalGrade; Voltage Rating: 50V; Case Length: 3.2mm; Dielectric: X7R; Temperature Coefficient / Code: +/-15%; Product Category: MultilayerCeramicCapacitorsMLCC-SMD/SMT; Package Description: 2-Pin Surface Mount Device, Body 3.2 x 1.6 mm; Minimum Operating Temperature: -55C; RoHS: Details; Package / Case: 1206(3216metric); Packaging: Reel; Case Code - mm: 3216; Datasheet Version: 02/2016; Tolerance: 10%; Series: C1206C; Dimensions: 1.6mmWx3.2mmLx1.6mmH; Case Height: 1.6mm; Brand: Kemet; Mounting Technology: SurfaceMount; Manufacturer URL: http://www.kemet.com/; Voltage Rating DC: 50V; Datasheet URL: http://www.kemet.com/docfinder?Partnumber=C1206C225K5RACTU; Maximum Operating Temperature: +125C; Case Code - in: 1206; Package Reference: 1206; Termination Style: SMD/SMT; Operating Temperature Range: -55Cto+125C; Product: GeneralTypeMLCCs; Factory Pack Quantity: 2000
C16 C17 C20 C22-C25 C28-C32 = CMP-1037-04379-2: CAP CER 0.22UF 25V 10% X7R 1206; Manufacturer: KEMET; Capacitance: 0.22 μF; Tolerance: 0.1; Temperature Coefficient: 15%; Value: 0.22 μF; Automotive Grade: Grade 0; Material: Ceramic; Package: C1206C-EB; Octopart: https://octopart.com/c1206c224k3ractu-kemet-107683; Mouser Description: 1206 C 220nF Ceramic Multilayer Capacitor; 25 VDC; +125degC; X7R Dielec; +/-10%; Temperature Characteristic: X7R; Device Class L1: Passive Components; Temperature Range Low: -55°C; Temperature: -55°C to +150°C; Ipc Land Pattern Name: CAPC320160X78; Automotive: Yes; Height: 0.88mm; Device Class L3: Ceramic Capacitors; Digikey Description: CAP CER 0.22UF 25V 10% X7R 1206; Category: Cap; Device Class L2: Capacitors; Lead Free: Yes; ComponentLink2Description: Datasheet; Voltage Rating: 25 V; Temperature Range High: +150°C; ComponentLink2URL: https://content.kemet.com/datasheets/KEM_C1007_X8R_ULTRA_150C_SMD.pdf; Manufacturer Part Number: C1206C224K3RACTU; RoHS: TRUE
C18 = CMP-1037-03764-2: Chip Multilayer Ceramic Capacitors for General Purpose, 1206, 22000pF, C0G, 30ppm/°C, 5%, 50V; Capacitance: 22nF; Insulation Resistance: 10GR; Dielectric: C0G; Dielectric Material: Ceramic; Termination: SMD/SMT; Voltage Rating: 50V; Width: 0.063inch; Number of Pins: 2; Mount: Surface Mount; REACH SVHC: No SVHC; Series: GRM; Voltage: 50V; Length: 3.2mm; Thickness: 0.037inch; Radiation Hardening: No; Case/Package: 1206; Case Code (Metric): 3216; Min Operating Temperature: -55°C; Package Quantity: 4000; Lead Free: Lead Free; Voltage Rating (DC): 50V; Height: 0.85mm; Depth: 1.6mm; Max Operating Temperature: 125°C; Packaging: Tape and Reel; Tolerance: 5%; Construction: Flat; Material: Ceramic; Temperature Coefficient: 30ppm/°C; Case Code (Imperial): 1206
C26 = CMP-03020-008490-1: Multilayer Ceramic Capacitor, C Series, 100 Pf, - 5%, C0g / Np0, 50 V, 1206 [3216 Metric]; Manufacturer: KEMET; Capacitance: 100 pF; Automotive Grade: Grade 0; Temperature Coefficient: 15%; Tolerance: 0.05; Voltage Rating: 50 V; Value: 100 pF; Octopart: https://octopart.com/c1206c101j5gactu-kemet-102340; Category: Cap; Device Class L2: Capacitors; Temperature: -55°C to +150°C; Material: Ceramic; ComponentLink2Description: Datasheet; Temperature Range High: +150°C; ComponentLink2URL: https://content.kemet.com/datasheets/KEM_C1007_X8R_ULTRA_150C_SMD.pdf; Ipc Land Pattern Name: CAPC320160X78; Device Class L3: Ceramic Capacitors; Package: C1206C-EB; Lead Free: Yes; Height: 0.88mm; Digikey Description: Multilayer Ceramic Capacitor, C Series, 100 Pf, - 5%, C0g / Np0, 50 V, 1206 [3216 Metric]; Manufacturer Part Number: C1206C101J5GACTU; Device Class L1: Passive Components; Automotive: Yes; RoHS: TRUE; Temperature Range Low: -55°C; Temperature Characteristic: C0G; Mouser Description: Multilayer Ceramic Capacitors MLCC - SMD/SMT 50volts 100pF C0G 5%
C27 = CMP-1037-04222-2: as C1 on sheet Sheet3; Automotive: Yes; Temperature Characteristic: X7R; Digikey Description: CAP CER 0.1UF 200V 10% X7R 1206; ComponentLink2URL: https://content.kemet.com/datasheets/KEM_C1007_X8R_ULTRA_150C_SMD.pdf; Voltage Rating: 200 V; Manufacturer Part Number: C1206C104K2RACTU; Temperature Range High: +150°C; Device Class L1: Passive Components; Octopart: https://octopart.com/c1206c104k2ractu-kemet-9138344; Temperature: -55°C to +150°C; Height: 0.88mm; Device Class L3: Ceramic Capacitors; Lead Free: Yes; Package: C1206C-EB; Category: Cap; Temperature Range Low: -55°C; Mouser Description: Multilayer Ceramic Capacitors MLCC - SMD/SMT 200volts 0.1uF X7R 10%; Ipc Land Pattern Name: CAPC320160X78; Capacitance: 0.10 μF; RoHS: TRUE; ComponentLink2Description: Datasheet; Device Class L2: Capacitors
D1-D3 = CMP-1060-00302-1: Zener Voltage Regulator, 500 mW, 2-Pin SOD-123, Pb-Free, Tape and Reel; Manufacturer: On Semiconductor; P Max (W): 0.5; VZ Typ (V): 16; ComponentLink1URL: http://www.onsemi.com/; Mounting Technology: Surface Mount; ComponentLink2Description: Datasheet; ComponentLink3URL: http://www.onsemi.com/pub_link/Collateral/425-04.PDF; PackageVersion: Rev. G, 10/2009; Packing: Tape and Reel; ComponentLink1Description: Manufacturer URL; ComponentLink2URL: http://www.onsemi.com/pub_link/Collateral/MMSZ4678T1-D.PDF; PackageReference: SOD-123-2-425-04; RoHS: Pb-Free; ComponentLink3Description: Package Specification; PartNumber: MMSZ4703T1G; DatasheetVersion: Rev. 9; PackageDescription: 2-Pin SOD, Body 1.6 x 2.69 mm
D4 D5 D11 D12 = CMP-2000-04932-2: Fast Switching Diode, 100 V, 0.15 A, -65 to 150 degC, 2-Pin?SOD123, RoHS, Tape and Reel; Recovery Time: 4ns; Brand: DiodesIncorporated; Unit Weight: 0.000353oz; Max Surge Current: 2A; Peak Reverse Voltage: 100V; Ir - Reverse Current: 1uA; Vf - Forward Voltage: 1.25V; Configuration: Single; If - Forward Current: 0.15A; Product Category: Diodes-GeneralPurpose,Power,Switching; Operating Temperature Range: -65Cto+150C; Packaging: Reel; Manufacturer URL: http://www.diodes.com/; Maximum Operating Temperature: +150C; Height: 1.25mm; Minimum Operating Temperature: -65C; Product: SwitchingDiodes; Package URL: http://www.diodes.com/datasheets/ds18004.pdf; Type: SwitchingDiode; Package Reference: SOD123-2; Width: 1.7mm; Datasheet URL: http://www.farnell.com/datasheets/1915529.pdf; Datasheet Version: Rev. 24-2, 10/2013; Series: 1N4148; Factory Pack Quantity: 3000; Length: 2.85mm; RoHS: True; Manufacturer: DiodesIncorporated; Mounting Style: SMD/SMT; Package / Case: SOD-123
D6-D8 = CMP-0303-00004-1: Surface Mount Schottky Barrier Diode, 100 V, -55 to 125 degC, 2-Pin SOD123, RoHS, Tape and Reel; Manufacturer: Diodes Inc; IR@1.5 V: 0.3 uA Max.; V(BR)R: 100 V Min.; VF@10 mA: 0.45 V Max.; CT@1 V: 12 pF Typ.; PartNumber: BAT46W-7-F; ComponentLink1URL: http://www.diodes.com/; ComponentLink3URL: http://diodes.com/datasheets/ds30044.pdf; PackageDescription: 2-Pin SMD, Body 2.7 x 1.55 mm, Height 1.45 mm; ComponentLink2Description: Datasheet; ComponentLink3Description: Package Specification; Mounting Technology: Surface Mount; ComponentLink1Description: Manufacturer URL; RoHS: TRUE; Operating Temperature: -55 to 125 degC; Packing: Tape and Reel; ComponentLink2URL: http://diodes.com/datasheets/ds30044.pdf; DatasheetVersion: Rev. 16-2
D9 D10 = CMP-14432-000001-1: TVS DIODE 5V 14V SOD323
J1 = CMP-15831-000009-1: CONN HEADER VERT 2POS 2.54MM; Manufacturer: Harwin; Conn Gender: Male; Conn Orientation: Vertical; Number Of Contacts: 2; Current Rating: 3A; ComponentLink2URL: https://cdn.harwin.com/pdfs/M20-999.pdf; ComponentLink2Description: Datasheet; Package: M20-9990246; Temperature: -40°C to +105°C; Octopart: https://octopart.com/m20-9990246-harwin-2590635; Mouser Description: 2.54mm (0.1") Pitch SIL Vertical PC Tail Pin Header, 6.1mm mating pin height, tin, 2 contacts; Temperature Range High: +105°C; Device Class L1: Connectors; RoHS: TRUE; Automotive: No; Height: 8.99mm; Number Of Rows: 1; Contact Material: Tin,Nickel; Category: Conn; Pitch: 2.54mm; Lead Free: Yes; Digikey Description: CONN HEADER VERT 2POS 2.54MM; Manufacturer Part Number: M20-9990246; Temperature Range Low: -40°C; Device Class L3: unset; Device Class L2: Headers and Wire Housings
P8 = CMP-1502-01863-2: NexarPartId: 8917771; Number of Levels: 1; Pitch: 3.81mm; Voltage Rating: 300V; Number of Positions Per Level: 2; Current: 20A; Gender: Male; Current Rating: 10A; RoHS: Compliant; Length: 7mm; Mount: Through Hole; Max Operating Temperature: 105°C; Termination: Solder; Contact Plating: Tin; Min Operating Temperature: -40°C; Lead Pitch: 3.81mm; Contact Material: Brass; REACH SVHC: Unknown; Packaging: Box; Number of Rows: 1; Color: Green; Height: 9.4mm; Orientation: Vertical; Voltage: 300V; Width: 8.71mm; Number of Pins: 2; Number of Contacts: 2; Lead Free: Lead Free
P9 = CMP-1502-01068-3: as P1 on sheet Sheet3; Lead Free: Lead Free; Color: Black; Packaging: Bulk; Lead Pitch: 2.54mm; Contact Material: Copper; Min Operating Temperature: -40°C; Contact Mating Length: 5.9944mm; Voltage Rating: 250V; Number of Pins: 5; Number of Positions: 5; Height: 8.89mm; Orientation: Vertical; REACH SVHC: Unknown; RoHS: Compliant; Contact Plating: Gold; Max Operating Temperature: 105°C; Mount: Through Hole; Number of Rows: 1; Termination: Solder
P10 P12 P13 = CMP-1502-01064-3: NexarPartId: 32855522; Operating Supply Voltage: 250V; Pitch: 2.54mm; Contact Resistance: 20mΩ; Number of Positions: 4; Current Rating: 3A; Connector Type: Male Pin; Gender: Male; Contact Plating: Gold; Height: 8.89mm; Lead Pitch: 2.54mm; Lead Free: Lead Free; Contact Mating Length: 5.9944mm; Number of Rows: 1; Termination: Solder; Packaging: Bulk; REACH SVHC: Unknown; Min Operating Temperature: -40°C; RoHS: Compliant; Number of Contacts: 4; Voltage Rating: 250V; Color: Black; Max Operating Temperature: 105°C; Contact Material: Copper; Mount: Through Hole; Orientation: Vertical; Number of Pins: 4
P11 = CMP-1502-01872-2: NexarPartId: 105951112
Q1 Q2 = CMP-04962-000007-1: MOSFET N-CH 100V 100A 8SON; Manufacturer: Texas Instruments; Depletion Mode: False; Number Of Channels: 1; Gate To Source Voltage: 20V; Reverse Recovery Time: 80ns; Input Capacitace At Vds: 3700pF @ 50V; Max Forward Diode Voltage: 1V; Turn Off Delay Time: 22ns; Drain To Source Resistance: 4.6mΩ; Threshold Vgs Max: 3.2V; Max Junction Temp: +150°C; Turn On Delay Time: 7ns; Pulse Drain Current: 400A; Rthja Max: 50°C/W; Typ Forward Diode Voltage: 0.8V; Reverse Recovery Charge: 249nC; Threshold Vgs Min: 2.2V; Gate Charge At Vgs: 48nC @ 10V; Power Dissipation: 3.1W; Transconductance: 84S; Temperature Range Low: -55°C; Automotive: No; RoHS: TRUE; Temperature: -55°C to +150°C; Device Class L3: MOSFETs; Continuous Drain Current: 100A; Number Of N Channels: 1; Height: 1.05mm; Mouser Description: MOSFET 100V 4.0 mOhm N-Ch NexFET Power MOSFET; Drain To Source Voltage: 100V; Temperature Range High: +150°C; Manufacturer Part Number: CSD19532Q5B; Octopart: https://octopart.com/csd19532q5b-texas+instruments-32890191; ComponentLink2URL: http://www.ti.com/lit/ds/symlink/csd19532q5b.pdf; Lead Free: Yes; Drain To Source Breakdown Voltage: 100V; Device Class L1: Discrete Semiconductors; Device Class L2: Transistors; Package: DNK0008A; Digikey Description: MOSFET N-CH 100V 100A 8SON; Category: Trans; ComponentLink2Description: Datasheet
R15-R17 = CMP-03412-049943-1: Thin Film Chip Resistors Automotive Grade 100kΩ 0.1% 25ppm/°C 1206; Resistance: 100kR; Max Power Dissipation: 250mW; Temperature Coefficient: 25ppm/°C; Resistor Type: Thin Film; Case/Package: 1206; Min Operating Temperature: -55°C; Tolerance: 0.1%; RoHS Compliant: Yes; Packaging: Tape and Reel; Number of Terminations: 2; Max Operating Temperature: 155°C; Length: 0.122inch; Height: 0.026inch; Width: 0.063inch; Series: AT; Features: Moisture Resistant
R18 R19 R21-R24 R26 = CMP-1014-00590-3: RES Thick Film, 5.1kΩ, 1%, 0.25W, 100ppm/°C, 1206; Voltage Rating (DC): 200V; Max Power Dissipation: 250mW; Resistance: 5.1kR; Features: Automotive AEC-Q200; Weight: 0.000353oz; Case Code (Imperial): 1206; Case/Package: 1206; Min Operating Temperature: -55°C; Max Operating Temperature: 155°C; Height: 0.55mm; Termination: SMD/SMT; Case Code (Metric): 3216; Power Rating: 250mW; Lead Free: Lead Free; Contact Plating: Tin; Tolerance: 1%; Depth: 1.6mm; Composition: Thick Film; Radiation Hardening: No; Military Standard: Not; Packaging: Tape and Reel; Width: 1.6mm; Voltage Rating: 200V; Package Quantity: 10; Temperature Coefficient: 100ppm/°C; Length: 3.2mm; Number of Terminations: 2
R20 = CMP-07231-005593-1: Thick Film Chip Resistors 1206 10kΩ 0.25W 5% 200ppm/°C; Voltage Rating: 200V; Resistance: 10kR; Max Power Dissipation: 250mW; Temperature Coefficient: 200ppm/°C; Height: 0.6mm; Case Code (Imperial): 1206; REACH SVHC: No SVHC; Depth: 1.6mm; Mount: Surface Mount; Termination: SMD/SMT; Case/Package: 1206; Min Operating Temperature: -55°C; Features: Moisture Resistant; Number of Pins: 2; Length: 3.2mm; Military Standard: Not; Radiation Hardening: No; Max Operating Temperature: 155°C; Power Rating: 250mW; Case Code (Metric): 3216; Package Quantity: 1; Composition: Thick Film; Tolerance: 5%; Voltage Rating (DC): 200V; Contact Plating: Tin; Thickness: 610um; Number of Terminations: 2; Packaging: Tape and Reel; Width: 1.6mm
R25 R30 R33 R45 = CMP-2003-04880-1: Manufacturer: Vishay Dale; Part Number: CRCW12061K00JNEAHP
R27 = CMP-2003-00116-1: Manufacturer: Panasonic; Part Number: ERJ-8ENF1500V
R28 R38 R47 = CMP-2003-04801-2: as R11 on sheet Sheet3; Case Code (Metric): 3216; Radiation Hardening: No; Height: 0.55mm; Packaging: Tape and Reel; Depth: 1.6mm; Weight: 0.000353oz; Termination: SMD/SMT; Lead Free: Lead Free; Min Operating Temperature: -55°C; Contact Plating: Tin; Max Operating Temperature: 155°C; Case Code (Imperial): 1206; Military Standard: Not; Width: 1.6mm; Number of Pins: 2; Voltage Rating: 200V; Composition: Thick Film; Package Quantity: 5000; Tolerance: 1%; Case/Package: 1206; Mount: Surface Mount; Length: 3.2mm; Temperature Coefficient: 100ppm/°C
R29 R31 R32 R34 R35 R37 R40 R44 R46 R48 R49 = CMP-2003-01945-2: RES Thick Film, 20Ω, 5%, 0.25W, 200ppm/°C, 1206; Voltage Rating (DC): 200V; Resistance: 20R; Power Rating: 250mW; Contact Plating: Tin; Military Standard: Not; Termination: SMD/SMT; Length: 3.2mm; Composition: Thick Film; Number of Terminations: 2; Lead Free: Lead Free; Min Operating Temperature: -55°C; Width: 0.063inch; Radiation Hardening: No; Max Operating Temperature: 155°C; Depth: 1.6mm; Case/Package: 1206; Features: Automotive AEC-Q200; Voltage Rating: 200V; Height: 0.024inch; Weight: 0.000353oz; Case Code (Metric): 3216; Packaging: Tape and Reel; Case Code (Imperial): 1206; Package Quantity: 1; Temperature Coefficient: 200ppm/°C; Max Power Dissipation: 250mW; Tolerance: 5%
R36 R39 = CMP-2000-05824-2: Thermistor NTC 10KOhm 1% 2-Pin; Resistance: 10kR; Lead Pitch: 2.54mm; Height: 2.4mm; Max Operating Temperature: 110°C; Width: 3.7mm; RoHS Compliant: Yes; Min Operating Temperature: -50°C; Termination: Radial; Packaging: Bulk; Number of Pins: 2; Series: AT; Tolerance: 1%; Length: 17mm
R41 R42 R50 = CMP-2003-04807-2: as R1 on sheet Sheet3; Tolerance: 1%; Width: 0.063inch; Height: 0.55mm; Number of Pins: 2; Voltage Rating: 200V; Temperature Coefficient: 100ppm/°C; Military Standard: Not; Features: Automotive AEC-Q200; Depth: 1.6mm; Radiation Hardening: No; Termination: SMD/SMT; Case Code (Imperial): 1206; Weight: 0.000353oz; Length: 3.2mm; Package Quantity: 10; Voltage Rating (DC): 200V; Case/Package: 1206; Min Operating Temperature: -55°C; Number of Terminations: 2; Composition: Thick Film; Contact Plating: Tin; Power Rating: 250mW; Packaging: Tape and Reel; Max Operating Temperature: 155°C; Lead Free: Lead Free; Case Code (Metric): 3216
R43 = CMP-1018-00001-1: Jumper 2512 (6432 Metric); Tolerance: None; Case-EIA: 2512; Value: 0.00 Ohm; Case-Metric: 6432; Technology: SMT; Power: None
U3 = CMP-04911-000083-1: 3-SERIES TO 10-SERIES MULTICELL
U4 = FCX495TA: Bipolar (BJT) Transistor NPN 150 V 1 A 100MHz 1 W Surface Mount SOT-89-3; MF: Diodes Inc.; SnapEDA_Link: https://www.snapeda.com/parts/FCX495TA/Diodes+Inc./view-part/?ref=snap; Package: SOT-89-3 Diodes Inc.; Value: *; MP: FCX495TA; Check_prices: https://www.snapeda.com/parts/FCX495TA/Diodes+Inc./view-part/?ref=eda

## Nets that join several sheets
GND: Sheet3 (23 pins), Sheet1 (24 pins)